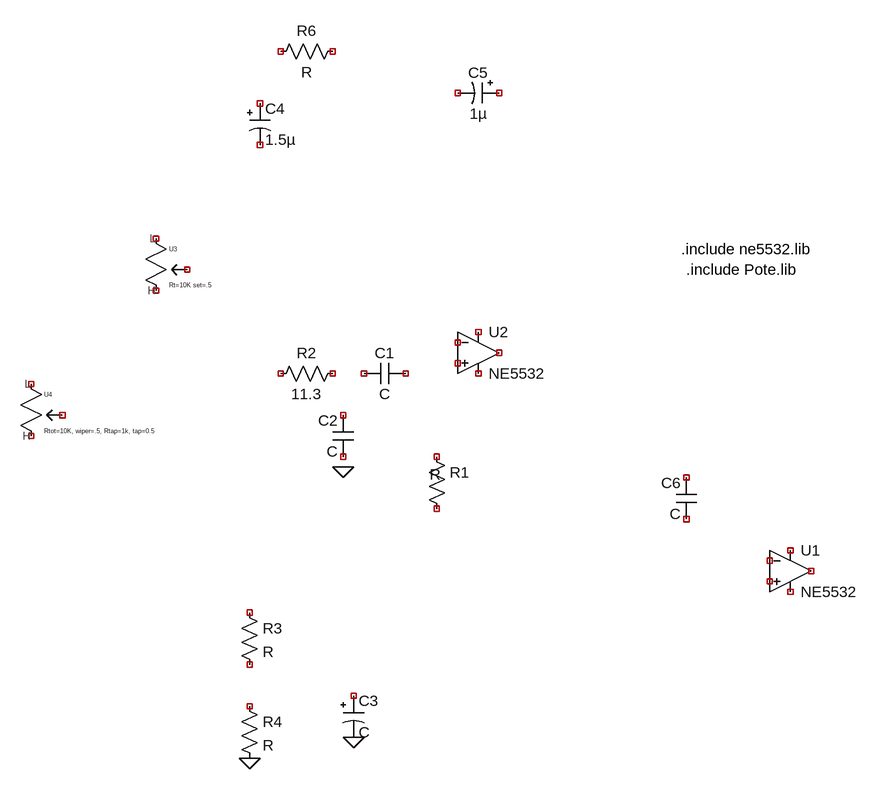
[diagram p0: schematic neill1.asc]
neill1.asc, the LTspice schematic file:
Version 4
SHEET 1 1100 1296
FLAG -96 416 0
FLAG -80 832 0
FLAG -240 864 0
SYMBOL OpAmps\\opamp2 592 512 R0
SYMATTR InstName U1
SYMATTR Value NE5532
SYMBOL OpAmps\\opamp2 112 176 R0
SYMATTR InstName U2
SYMATTR Value NE5532
SYMBOL res 32 384 R0
WINDOW 3 5 43 Left 2
SYMATTR InstName R1
SYMBOL res -96 256 R90
WINDOW 0 0 56 VBottom 2
WINDOW 3 32 56 VTop 2
SYMATTR InstName R2
SYMATTR Value 11.3
SYMATTR SpiceLine tol=1 pwr=0.1
SYMBOL res -256 624 R0
SYMATTR InstName R3
SYMBOL res -256 768 R0
SYMATTR InstName R4
SYMBOL res -96 -240 R90
WINDOW 0 0 56 VBottom 2
WINDOW 3 32 56 VTop 2
SYMATTR InstName R6
SYMBOL cap 0 256 R90
WINDOW 0 0 32 VBottom 2
WINDOW 3 32 32 VTop 2
SYMATTR InstName C1
SYMBOL cap -80 400 R180
WINDOW 0 24 56 Left 2
WINDOW 3 24 8 Left 2
SYMATTR InstName C2
SYMBOL polcap -240 -144 R0
WINDOW 3 24 56 Left 2
SYMATTR InstName C4
SYMATTR Value 1.5µ
SYMATTR Description Capacitor
SYMATTR Type cap
SYMATTR SpiceLine V=16 Irms=0 Rser=8 Lser=0 mfg="AVX" pn="TAJA155K016" type="Tantalum"
SYMBOL polcap 144 -176 R90
WINDOW 0 0 32 VBottom 2
WINDOW 3 32 32 VTop 2
SYMATTR InstName C5
SYMATTR Value 1µ
SYMATTR Description Capacitor
SYMATTR Type cap
SYMATTR SpiceLine V=16 Irms=0 Rser=11 Lser=0 mfg="AVX" pn="TAJA105K016" type="Tantalum"
SYMBOL cap 448 496 R180
WINDOW 0 24 56 Left 2
WINDOW 3 24 8 Left 2
SYMATTR InstName C6
SYMBOL polcap -96 768 R0
SYMATTR InstName C3
SYMBOL pot -400 48 R0
SYMATTR InstName U3
SYMBOL pot -592 272 R0
SYMATTR InstName U4
SYMATTR Value Rtot=10K, wiper=.5, Rtap=1k, tap=0.5
TEXT 424 80 Left 2 !.include ne5532.lib
TEXT 432 112 Left 2 !.include Pote.lib

The netlist it stands for:
* neill1.asc
XU1 NC_01 NC_02 NC_03 NC_04 NC_05 NE5532  ; pins In+ In- V+ V- OUT
XU2 NC_06 NC_07 NC_08 NC_09 NC_10 NE5532  ; pins In+ In- V+ V- OUT
R1 NC_11 NC_12 R
R2 NC_13 NC_14 11.3 tol=1 pwr=0.1
R3 NC_15 NC_16 R
R4 NC_17 0 R
R6 NC_18 NC_19 R
C1 NC_20 NC_21 C
C2 NC_22 NC_23 C
C4 NC_24 NC_25 1.5µ V=16 Irms=0 Rser=8 Lser=0 mfg="AVX" pn="TAJA155K016" type="Tantalum"
C5 NC_26 NC_27 1µ V=16 Irms=0 Rser=11 Lser=0 mfg="AVX" pn="TAJA105K016" type="Tantalum"
C6 NC_28 NC_29 C
C3 NC_30 0 C
XU3 NC_31 NC_32 NC_33 potentiometer Rt=10K set=.5  ; pins H L 3
XU4 NC_34 NC_35 NC_36 potentiometer Rtot=10K, wiper=.5, Rtap=1k, tap=0.5  ; pins H L 3
.include ne5532.lib
.include Pote.lib
.lib pote.lib
.backanno
.end